# EAGLE schematic ETESTER-2 (EAGLE 9.6.2)
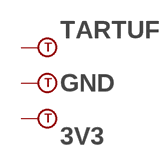
[diagram p0: schematic, sheet 1]

## Parts
3V3  TESPOINT-SMD1.5MM  [TESTPOINT-1.5MM]
GND  TESPOINT-SMD1.5MM  [TESTPOINT-1.5MM]
TARTUF  TESPOINT-SMD1.5MM  [TESTPOINT-1.5MM]
Unconnected: 3V3.1 GND.1 TARTUF.1

## Library data of the parts
3V3 GND TARTUF = Generics_stg:TESPOINT